# Altium schematic sheet sch_Connet&IMU.SchDoc
size A4
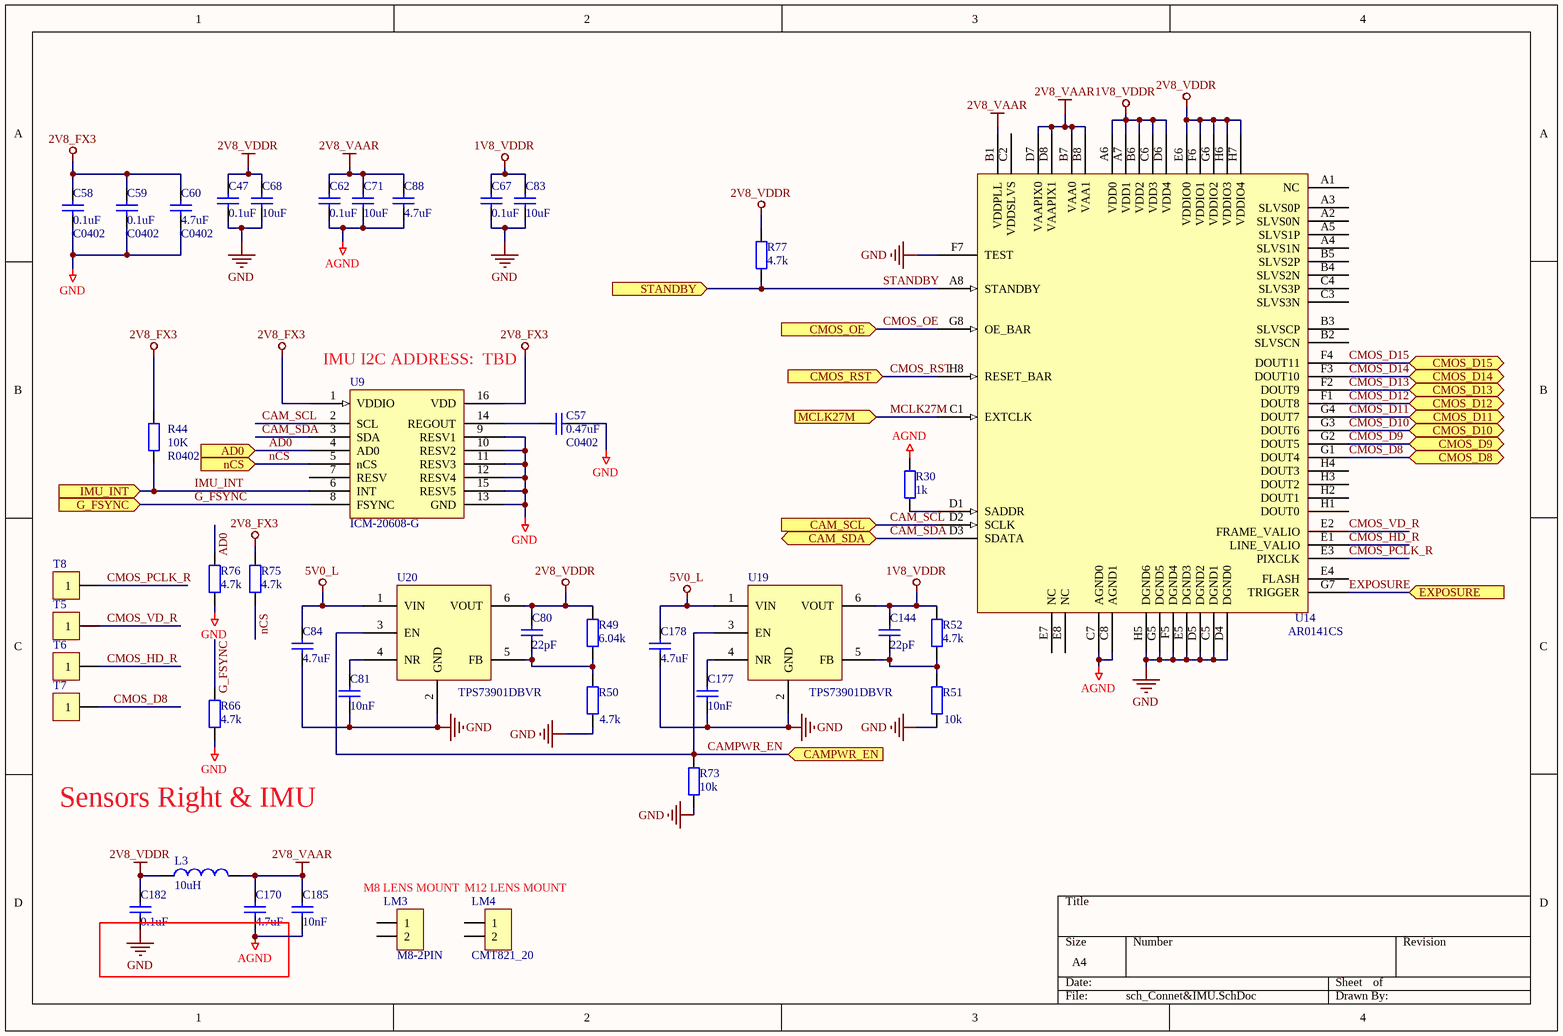
[diagram p0: sch_Connet&IMU.SchDoc]

## Parts
C47  0.1uF  [0402C]
C57  0.47uF  value C0402  [0402C]
C58  0.1uF  value C0402  [0402C]
C59  0.1uF  value C0402  [0402C]
C60  4.7uF  value C0402  [0402C]
C62  0.1uF  [0402C]
C67  0.1uF  [0402C]
C68  10uF  [0805C]
C71  10uF  [0805C]
C80  22pF  [0805C]
C81  10nF  [0402C_L]
C83  10uF  [0805C]
C84  4.7uF  [0402C_L]
C88  4.7uF  [0805C]
C144  22pF  [0402C]
C170  4.7uF  [0402C]
C177  10nF  [0402C_L]
C178  4.7uF  [0402C_L]
C182  0.1uF  [0402C_L]
C185  10nF  [0402C_L]
L3  10uH  [0805R]
LM3  M8-2PIN  [PAD_M3_D350_450]
LM4  CMT821_20  [PAD_M3_D350_450]
R30  1k  [0402R]
R44  10K  value R0402  [0402R]
R49  6.04K  [0402R]
R50  4.7K  [0402R]
R51  10K  [0402R]
R52  4.7K  [0402R]
R66  4.7K  [0402R]
R73  10K  [0402R_L]
R75  4.7K  [0402R]
R76  4.7K  [0402R]
R77  4.7K  [0402R]
T5  CON1  [PAD_TP_D1.2]  (value not drawn)
T6  CON1  [PAD_TP_D1.2]  (value not drawn)
T7  CON1  [PAD_TP_D1.2]  (value not drawn)
T8  CON1  [PAD_TP_D1.2]  (value not drawn)
U9  ICM-20608-G  [LGA16_P50L30W30H08]
U14  AR0141CS
U19  TPS73901DBVR
U20  TPS73901DBVR

## Ports
AD0 (in), CAM_SCL (in), CAM_SDA (bidir), CAMPWR_EN (in), CMOS_D8 (bidir), CMOS_D9 (bidir), CMOS_D10 (bidir), CMOS_D11 (bidir), CMOS_D12 (bidir), CMOS_D13 (bidir), CMOS_D14 (bidir), CMOS_D15 (bidir), CMOS_OE (in), CMOS_RST (in), EXPOSURE (in), G_FSYNC (in), IMU_INT (in), MCLK27M (in), nCS (in), STANDBY (in)

## Nets
1V8_VDDR: C67.2 C83.2 C144.2 R52.2 U14.A6(VDD0) U14.A7(VDD1) U14.B6(VDD2) U14.C6(VDD3) U14.D6(VDD4) U19.6(VOUT)
2V8_FX3: C58.2 C59.2 C60.2 R44.2 R75.2 U9.1(VDDIO) U9.16(VDD)
2V8_VAAR: C62.2 C71.2 C88.2 C170.2 C185.2 L3.2 U14.B1(VDDPLL) U14.B7(VAA0) U14.B8(VAA1) U14.D7(VAAPIX0) U14.D8(VAAPIX1)
2V8_VDDR: C47.2 C68.2 C80.2 C182.2 L3.1 R49.2 R77.2 U14.E6(VDDIO0) U14.F6(VDDIO1) U14.G6(VDDIO2) U14.H6(VDDIO3) U14.H7(VDDIO4) U20.6(VOUT)
5V0_L: C84.2 C178.2 U19.1(VIN) U20.1(VIN)
AGND: C62.1 C71.1 C88.1 C170.1 C185.1 R30.1 U14.C7(AGND0) U14.C8(AGND1)
GND: C47.1 C57.1 C58.1 C59.1 C60.1 C67.1 C68.1 C81.1 C83.1 C84.1 C177.1 C178.1 C182.1 R50.2 R51.2 R66.1 R73.2 R76.1 U9.9(RESV1) U9.10(RESV2) U9.11(RESV3) U9.12(RESV4) U9.13(GND) U9.15(RESV5) U14.C5(DGND1) U14.D4(DGND0) U14.D5(DGND2) U14.E5(DGND3) U14.F5(DGND4) U14.F7(TEST) U14.G5(DGND5) U14.H5(DGND6) U19.2(GND) U20.2(GND)
AD0: R76.2 U9.4(AD0) ; port AD0
CAM_SCL: U9.2(SCL) U14.D2(SCLK) ; port CAM_SCL
CAM_SDA: U9.3(SDA) U14.D3(SDATA) ; port CAM_SDA
CAMPWR_EN: R73.1 U19.3(EN) U20.3(EN) ; port CAMPWR_EN
CMOS_D8: T7.1 U14.G1(DOUT4) ; port CMOS_D8
CMOS_D9: U14.G2(DOUT5) ; port CMOS_D9
CMOS_D10: U14.G3(DOUT6) ; port CMOS_D10
CMOS_D11: U14.G4(DOUT7) ; port CMOS_D11
CMOS_D12: U14.F1(DOUT8) ; port CMOS_D12
CMOS_D13: U14.F2(DOUT9) ; port CMOS_D13
CMOS_D14: U14.F3(DOUT10) ; port CMOS_D14
CMOS_D15: U14.F4(DOUT11) ; port CMOS_D15
CMOS_HD_R: T6.1 U14.E1(LINE_VALIO)
CMOS_OE: U14.G8(OE_BAR) ; port CMOS_OE
CMOS_PCLK_R: T8.1 U14.E3(PIXCLK)
CMOS_RST: U14.H8(RESET_BAR) ; port CMOS_RST
CMOS_VD_R: T5.1 U14.E2(FRAME_VALIO)
EXPOSURE: U14.G7(TRIGGER) ; port EXPOSURE
G_FSYNC: R66.2 U9.8(FSYNC) ; port G_FSYNC
IMU_INT: R44.1 U9.6(INT) ; port IMU_INT
MCLK27M: U14.C1(EXTCLK) ; port MCLK27M
nCS: R75.1 U9.5(nCS) ; port nCS
STANDBY: R77.1 U14.A8(STANDBY) ; port STANDBY
NetC57_2: C57.2 U9.14(REGOUT)
NetC80_1: C80.1 R49.1 R50.1 U20.5(FB)
NetC81_2: C81.2 U20.4(NR)
NetC144_1: C144.1 R51.1 R52.1 U19.5(FB)
NetC177_2: C177.2 U19.4(NR)
NetR30_2: R30.2 U14.D1(SADDR)

Not connected (* = marked no-connect by the designer): LM3 1 2; LM4 1 2; U9 7(RESV); U14 A1(NC) A2(SLVS0N) A3(SLVS0P) A4(SLVS1N) A5(SLVS1P) B2(SLVSCN) B3(SLVSCP) B4(SLVS2N) B5(SLVS2P) C2(VDDSLVS) C3(SLVS3N) C4(SLVS3P) E4(FLASH) E7(NC) E8(NC) H1(DOUT0) H2(DOUT1) H3(DOUT2) H4(DOUT3)

## Notes on the sheet
- (near U9) IMU I2C ADDRESS:  TBD
- Sensors Right & IMU
- (near LM3) M8 LENS MOUNT
- (near LM4) M12 LENS MOUNT

## Library data of the parts
C47 C57-C60 C62 C67 C68 C71 C80 C81 C83 C84 C88 C144 C170 C177 C178 C182 C185 = Cap: Capacitor; Published: 8-Jun-2000; LatestRevisionDate: 17-Jul-2002; LatestRevisionNote: Re-released for DXP Platform.; Publisher: Altium Limited
  C47 C62 C67 C182: Value: 0.1uF
  C57-C60: PackageReference: RAD-0.3
  C68 C71 C83: PackageReference: RAD-0.3; Value: 10uF
  C80 C144: PackageReference: RAD-0.3; Value: 22pF
  C81 C177: PackageReference: RAD-0.3; Value: 10nF
  C84 C88 C170 C178: PackageReference: RAD-0.3; Value: 4.7uF
  C185: Value: 10nF
L3 = Inductor: Value: 330mH
LM3 LM4 = CON2: Connector
R30 R44 = Res2: Resistor; Published: 8-Jun-2000; LatestRevisionDate: 17-Jul-2002; LatestRevisionNote: Re-released for DXP Platform.; PackageReference: AXIAL-0.4; Publisher: Altium Limited
  R30: Value: 1k
R49-R52 R66 R73 R75-R77 = Resistor: Published: 8-Jun-2000; LatestRevisionDate: 17-Jul-2002; LatestRevisionNote: Re-released for DXP Platform.; PackageReference: AXIAL-0.4; Publisher: Altium Limited
  R49: Value: 6.04k
  R50 R52 R66 R75-R77: Value: 4.7k
  R51 R73: Value: 10k
T5-T8 = CON1: Connector